# Altium schematic sheet JW3651原理图与PCB.schdoc
size A4
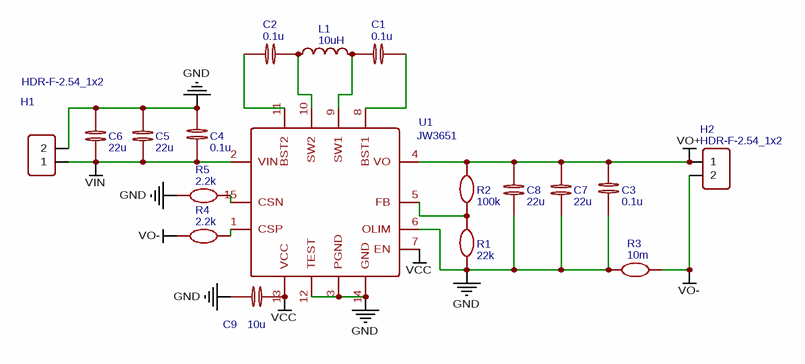
[diagram p0: JW3651原理图与PCB.schdoc]

## Parts
C1  0.1u  [C0603]
C2  0.1u  [C0603]
C3  0.1u  [C0603]
C4  0.1u  [C0603]
C5  22u  [C0805]
C6  22u  [C0805]
C7  22u  [C0805]
C8  22u  [C0805]
C9  10u  [C0603]
H1  HDR-F-2.54_1x2  [HDR-F-2.54_1X2]
H2  HDR-F-2.54_1x2  [HDR-F-2.54_1X2]
L1  10uH  [IND-SMD_L5.4-W5.2_FXL0530]
R1  22k  [R0603]
R2  100k  [R0603]
R3  10m  [R1206]
R4  2.2k  [R0603]
R5  2.2k  [R0603]
U1  JW3651  [JW3651]

## Nets
GND: C3.2 C4.1 C5.2 C6.2 C7.1 C8.1 C9.1 H1.2 R1.1 R3.1 R5.2 U1.3(PGND) U1.6(OLIM) U1.12(TEST) U1.14(GND)
VCC: C9.2 U1.7(EN) U1.13(VCC)
VIN: C4.2 C5.1 C6.1 H1.1 U1.2(VIN)
VO+: C3.1 C7.2 C8.2 H2.1 R2.2 U1.4(VO)
VO-: H2.2 R3.2 R4.2
NetC1_1: C1.1 L1.2 U1.9(SW1)
NetC1_2: C1.2 U1.8(BST1)
NetC2_1: C2.1 U1.11(BST2)
NetC2_2: C2.2 L1.1 U1.10(SW2)
NetR1_2: R1.2 R2.1 U1.5(FB)
NetR4_1: R4.1 U1.1(CSP)
NetR5_1: R5.1 U1.15(CSN)

## Library data of the parts
C1-C4 = 0.1u: nameAlias: Value(F); Contributor: LCEDA_Lib; spicePre: C; spiceSymbolName: C_0603_EU
C5-C8 = 22u: nameAlias: Value(F); Contributor: LCEDA_Lib; spicePre: C; spiceSymbolName: C_0805_EU
C9 = 10u: nameAlias: Value(F); Contributor: LCEDA_Lib; spicePre: C; spiceSymbolName: C_0603_EU
H1 H2 = HDR-F-2.54_1x2: Contributor: LCEDA_Lib; Supplier Part: C49661; Supplier: LCSC; spicePre: H; spiceSymbolName: HDR-F-2.54_1x2
L1 = 10uH: Manufacturer Part: FXL0530-100-M; nameAlias: Value; Contributor: wuzhixiong; Supplier: LCSC; Supplier Part: C177248; JLCPCB Part Class: Extended Part; link: https://so.szlcsc.com/global.html?k=C177248&ref=editor; spicePre: L; spiceSymbolName: FXL0530-100-M
R1 = 22k: Contributor: LCEDA_Lib; spicePre: R; spiceSymbolName: R_0603_EU
R2 = 100k: Contributor: LCEDA_Lib; spicePre: R; spiceSymbolName: R_0603_EU
R3 = 10m: Contributor: LCEDA_Lib; spicePre: R; spiceSymbolName: R_1206_EU
R4 R5 = 2.2k: Contributor: LCEDA_Lib; spicePre: R; spiceSymbolName: R_0603_EU
U1 = JW3651: spicePre: U